# Altium schematic sheet rone12_to_rone13.SchDoc
size A
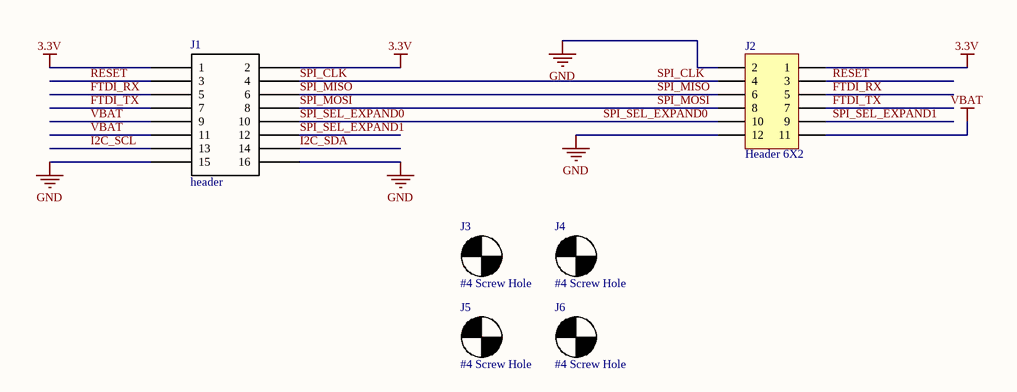
[diagram p0: rone12_to_rone13.SchDoc]

## Parts
J1  header  [HEADERSM 8X2]
J2  Header 6X2  [HDR2X6]
J3  #4 Screw Hole  [#4_Screw_Hole]
J4  #4 Screw Hole  [#4_Screw_Hole]
J5  #4 Screw Hole  [#4_Screw_Hole]
J6  #4 Screw Hole  [#4_Screw_Hole]

## Nets
3.3V: J1.1 J1.2 J2.1
GND: J1.15 J1.16 J2.2 J2.12
VBAT: J1.9 J1.11 J2.11
FTDI_RX: J1.5 J2.5
FTDI_TX: J1.7 J2.7
I2C_SCL: J1.13
I2C_SDA: J1.14
RESET: J1.3 J2.3
SPI_CLK: J1.4 J2.4
SPI_MISO: J1.6 J2.6
SPI_MOSI: J1.8 J2.8
SPI_SEL_EXPAND0: J1.10 J2.10
SPI_SEL_EXPAND1: J1.12 J2.9

## Library data of the parts
J1 = HEADER 8X2
J2 = Header 6X2: Header, 6-Pin, Dual row; LatestRevisionDate: 17-Jul-2002; LatestRevisionNote: Re-released for DXP Platform.; Publisher: Altium Limited
J3-J6 = Mechanical_Hole: A mechanical hole for mounting the board